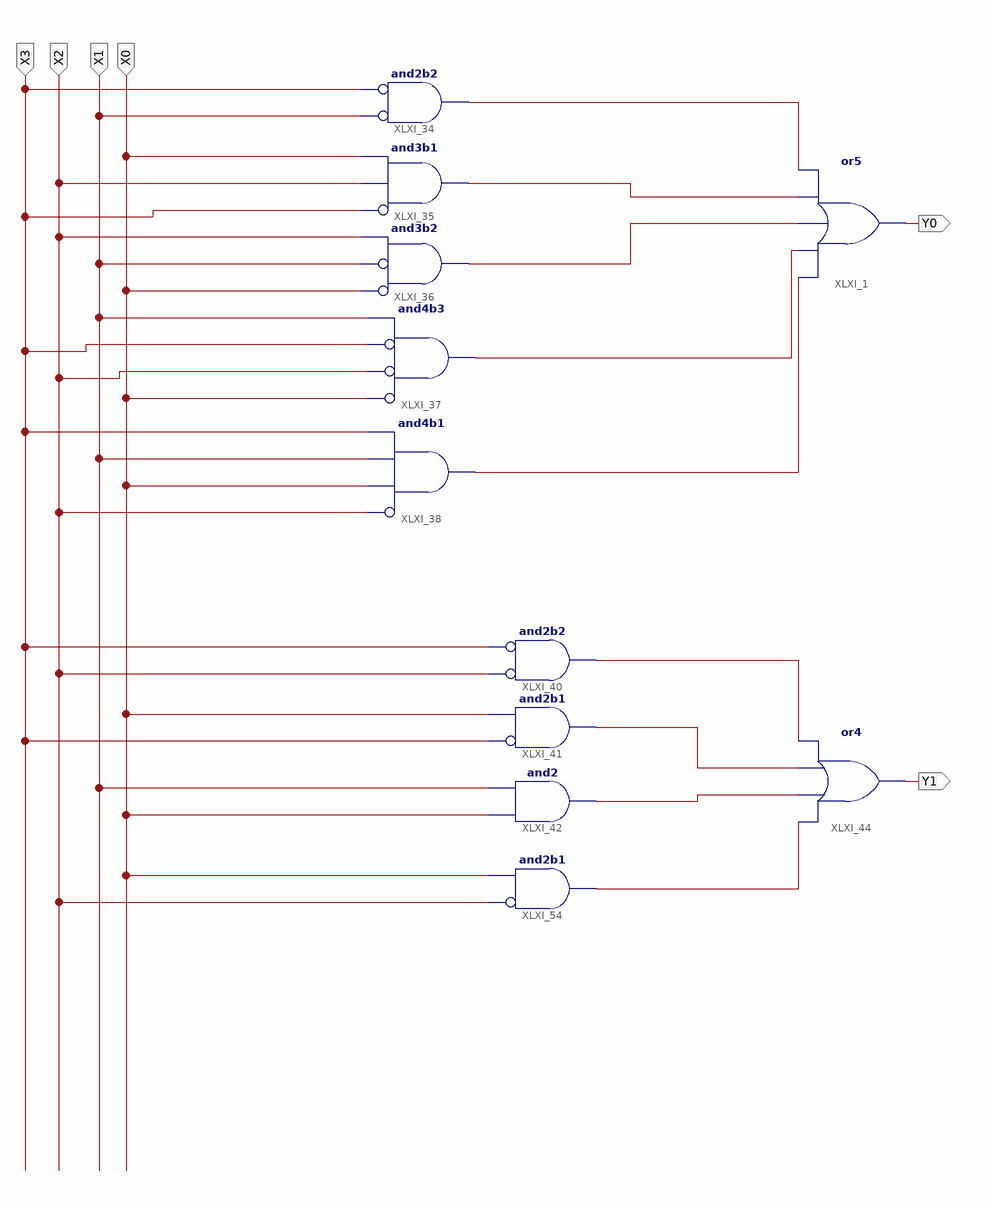
[diagram p0: schematic sheet 1]
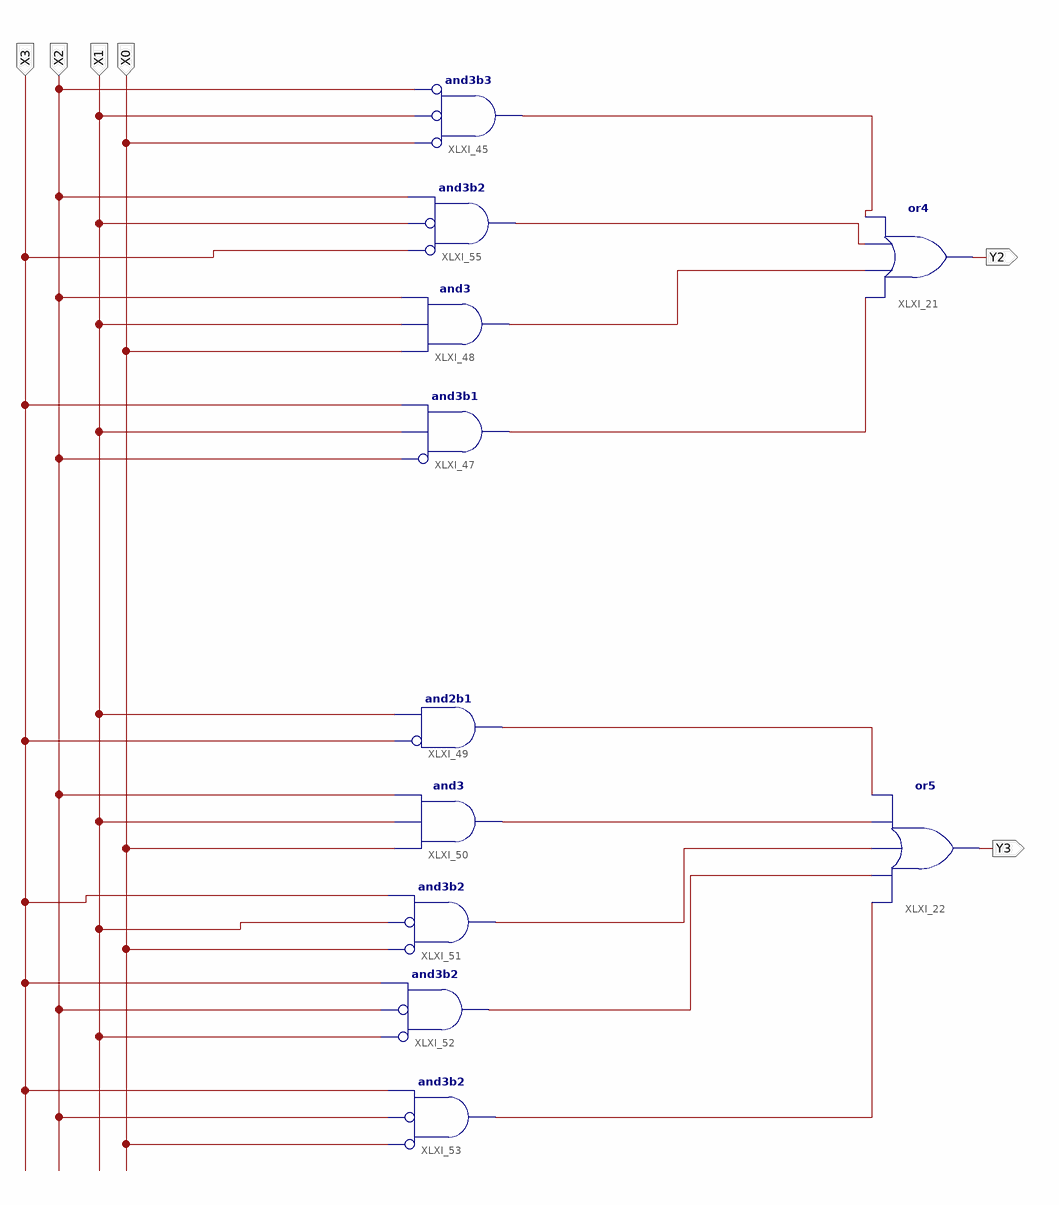
[diagram p1: schematic sheet 2]
// Xilinx ISE schematic DNF.sch (artix7) as structural Verilog: 22 symbols, 8 ports
module DNF (
  input  X3,
  input  X2,
  input  X1,
  input  X0,
  output Y0,
  output Y1,
  output Y2,
  output Y3
);

  wire XLXN_12, XLXN_15, XLXN_16, XLXN_17, XLXN_18, XLXN_27, XLXN_28, XLXN_29, XLXN_30, XLXN_32, XLXN_33,
       XLXN_34, XLXN_35, XLXN_36, XLXN_40, XLXN_41, XLXN_42, XLXN_43;

  or XLXI_1 (Y0, XLXN_18, XLXN_17, XLXN_16, XLXN_15, XLXN_12);
  or XLXI_21 (Y2, XLXN_30, XLXN_29, XLXN_28, XLXN_27);
  or XLXI_22 (Y3, XLXN_36, XLXN_35, XLXN_34, XLXN_33, XLXN_32);
  and XLXI_34 (XLXN_12, ~X1, ~X3);  // and2b2
  and XLXI_35 (XLXN_15, ~X3, X2, X0);  // and3b1
  and XLXI_37 (XLXN_17, ~X0, ~X2, ~X3, X1);  // and4b3
  and XLXI_38 (XLXN_18, ~X2, X0, X1, X3);  // and4b1
  and XLXI_36 (XLXN_16, ~X0, ~X1, X2);  // and3b2
  and XLXI_40 (XLXN_40, ~X2, ~X3);  // and2b2
  and XLXI_41 (XLXN_41, ~X3, X0);  // and2b1
  and XLXI_42 (XLXN_42, X0, X1);
  or XLXI_44 (Y1, XLXN_43, XLXN_42, XLXN_41, XLXN_40);
  and XLXI_47 (XLXN_30, ~X2, X1, X3);  // and3b1
  and XLXI_49 (XLXN_32, ~X3, X1);  // and2b1
  and XLXI_50 (XLXN_33, X0, X1, X2);
  and XLXI_51 (XLXN_34, ~X0, ~X1, X3);  // and3b2
  and XLXI_52 (XLXN_35, ~X1, ~X2, X3);  // and3b2
  and XLXI_53 (XLXN_36, ~X0, ~X2, X3);  // and3b2
  and XLXI_48 (XLXN_29, X0, X1, X2);
  and XLXI_45 (XLXN_27, ~X0, ~X1, ~X2);  // and3b3
  and XLXI_54 (XLXN_43, ~X2, X0);  // and2b1
  and XLXI_55 (XLXN_28, ~X3, ~X1, X2);  // and3b2
endmodule
